# EAGLE schematic Solar_Breakout (EAGLE 7.1.0)
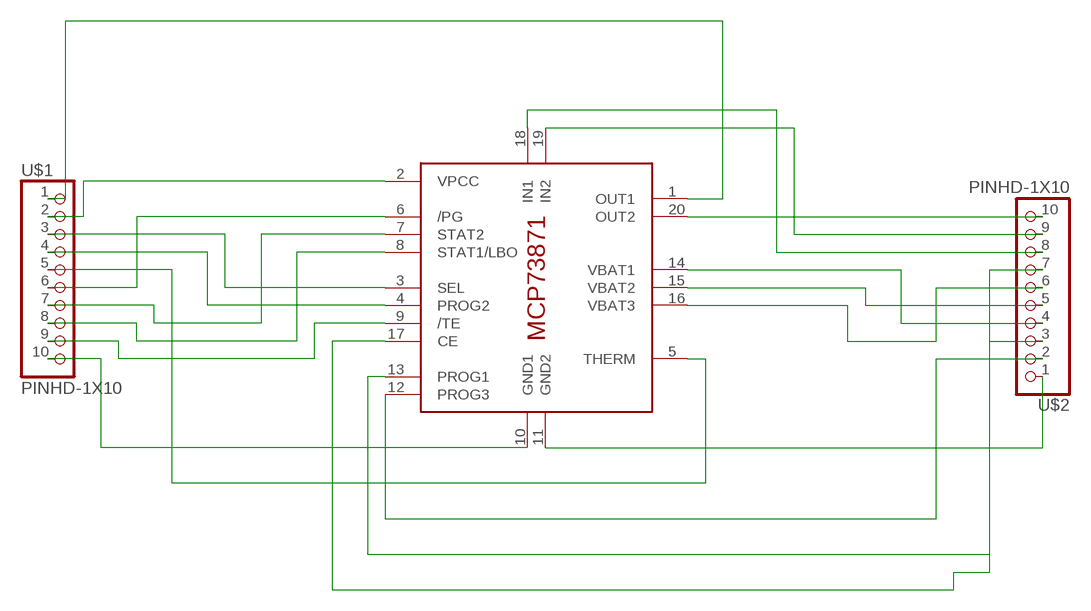
[diagram p0: schematic, sheet 1]

## Parts
IC1  MCP73871  [QFN20]
U$1  PINHD-1X10  [1X10-BIG]
U$2  PINHD-1X10  [1X10-BIG]

## Nets
N$1: IC1.1(OUT1) U$1.1
N$2: IC1.2(VPCC) U$1.2
N$3: IC1.3(SEL) U$1.3
N$4: IC1.4(PROG2) U$1.4
N$5: IC1.5(THERM) U$1.5
N$6: IC1.6(/PG) U$1.6
N$7: IC1.7(STAT2) U$1.7
N$8: IC1.8(STAT1/LBO) U$1.8
N$9: IC1.9(/TE) U$1.9
N$10: IC1.10(GND1) U$1.10
N$11: IC1.11(GND2) U$2.1
N$12: IC1.12(PROG3) U$2.2
N$13: IC1.13(PROG1) U$2.3
N$14: IC1.14(VBAT1) U$2.4
N$15: IC1.15(VBAT2) U$2.5
N$16: IC1.16(VBAT3) U$2.6
N$17: IC1.17(CE) U$2.7
N$18: IC1.18(IN1) U$2.8
N$19: IC1.19(IN2) U$2.9
N$20: IC1.20(OUT2) U$2.10

## Library data of the parts
IC1 = adafruit:MCP73871
U$1 U$2 = adafruit:PINHD-1X10: Pin header 1x10 0.1" spacing With round pins